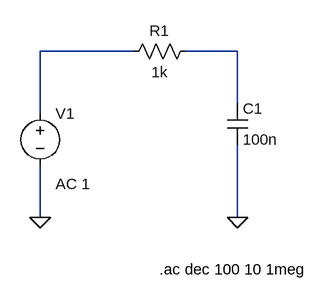
[diagram p0: schematic Low pass filter.asc]
Low pass filter.asc, the LTspice schematic file:
Version 4
SHEET 1 880 680
WIRE 224 32 80 32
WIRE 384 32 304 32
WIRE 384 112 384 32
WIRE 80 128 80 32
WIRE 80 288 80 208
WIRE 384 288 384 176
FLAG 80 288 0
FLAG 384 288 0
SYMBOL voltage 80 112 R0
WINDOW 123 24 124 Left 2
WINDOW 39 0 0 Left 0
SYMATTR Value2 AC 1
SYMATTR InstName V1
SYMATTR Value ""
SYMBOL res 320 16 R90
WINDOW 0 0 56 VBottom 2
WINDOW 3 32 56 VTop 2
SYMATTR InstName R1
SYMATTR Value 1k
SYMBOL cap 368 112 R0
SYMATTR InstName C1
SYMATTR Value 100n
TEXT 264 368 Left 2 !.ac dec 100 10 1meg

The netlist it stands for:
* Low pass filter.asc
V1 N001 0 AC 1
R1 N002 N001 1k
C1 N002 0 100n
.ac dec 100 10 1meg
.backanno
.end